# Altium project tinyCore.PrjPcb
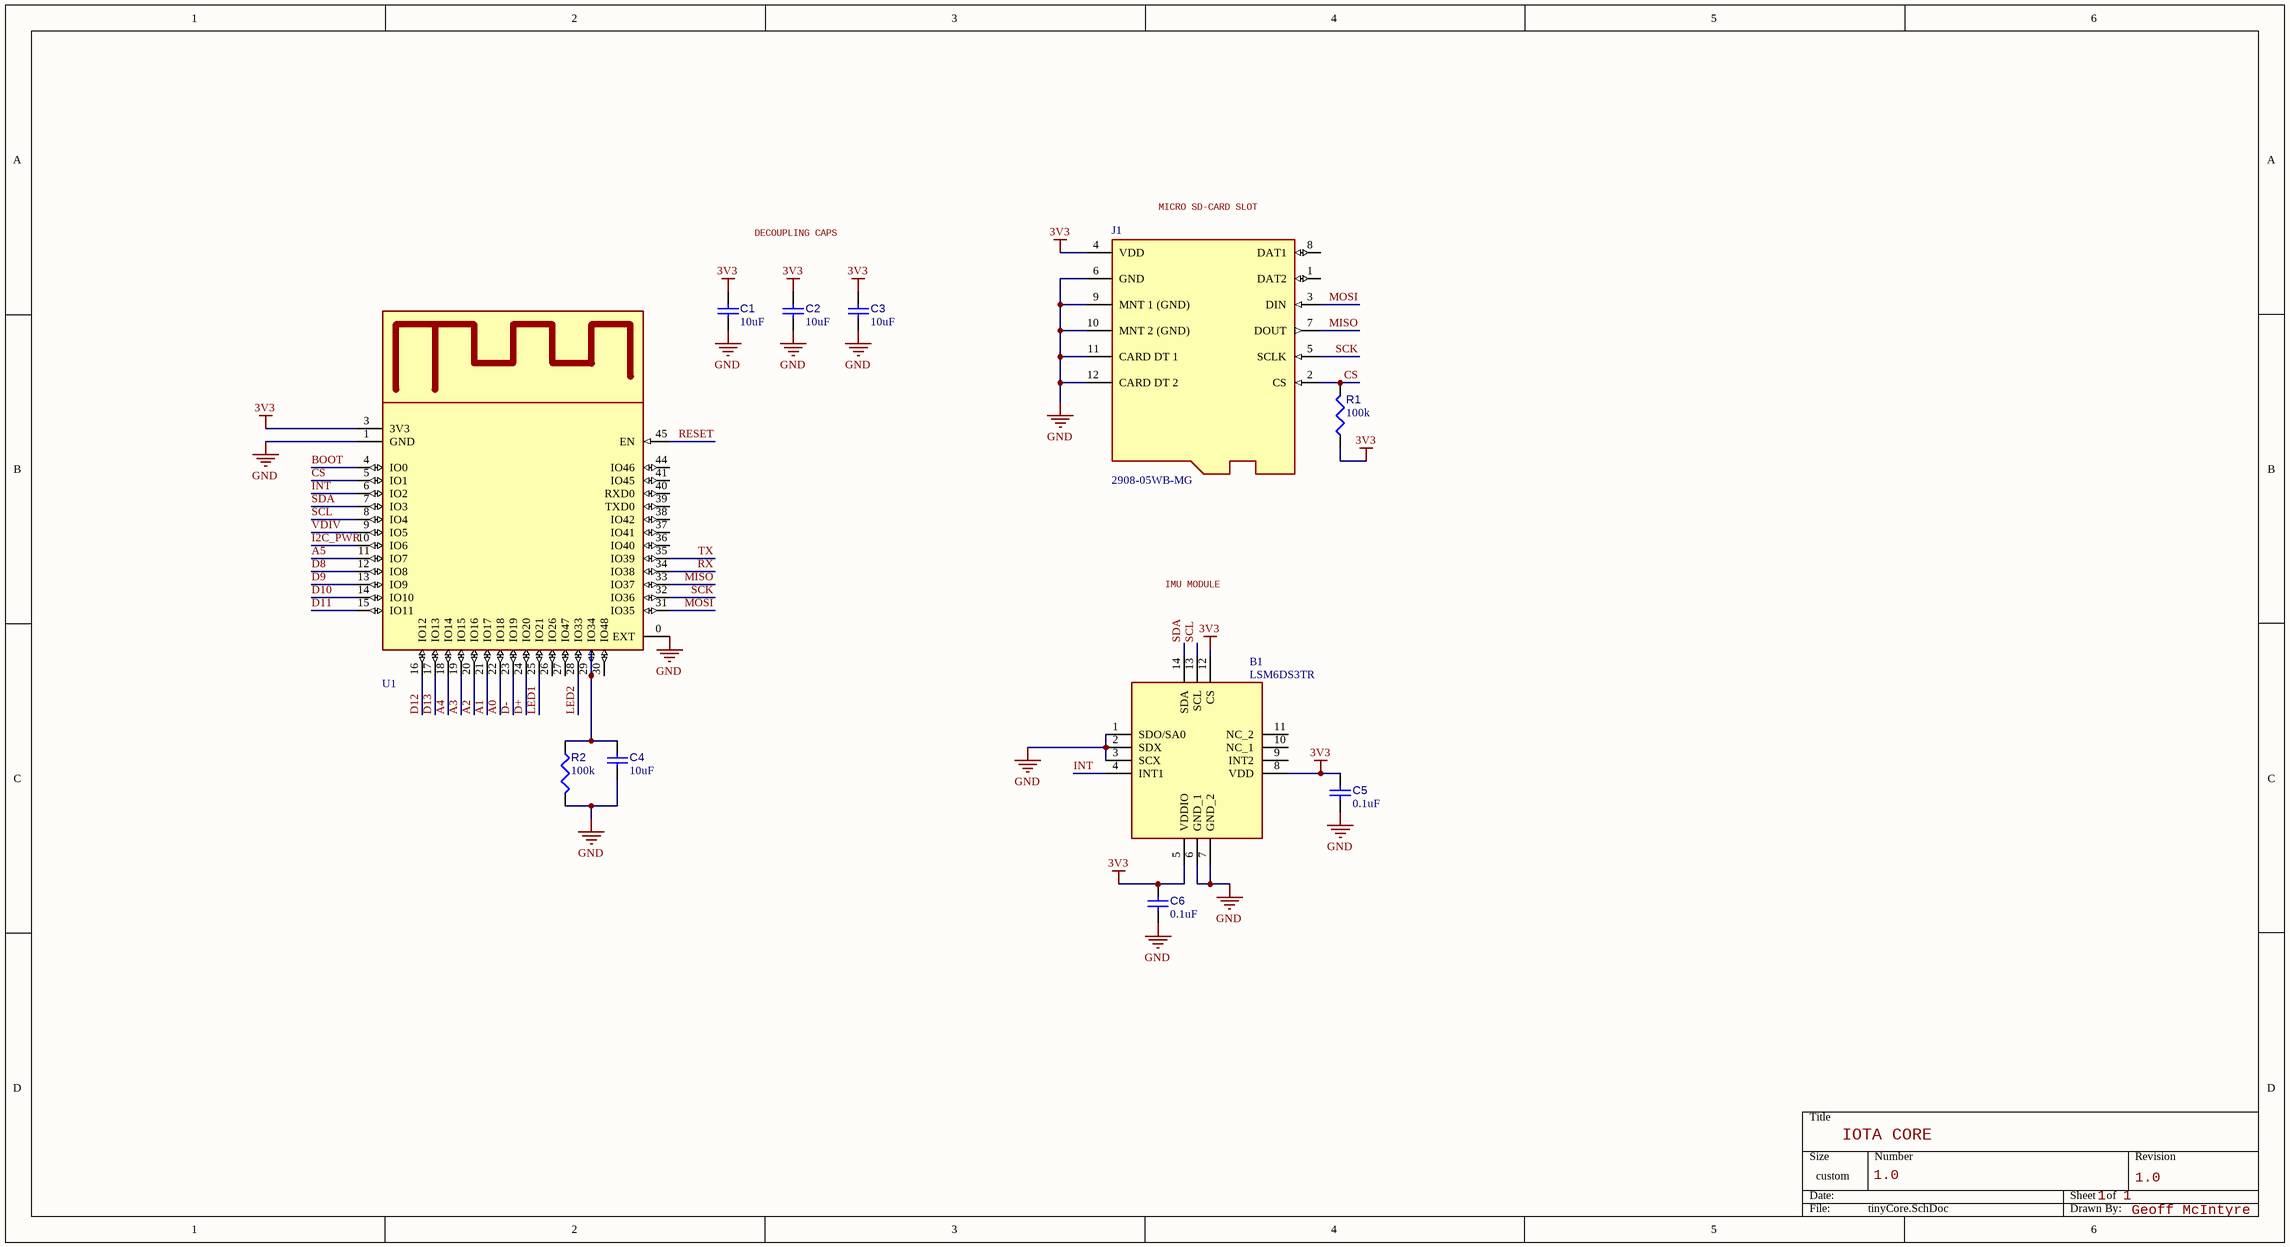
[diagram p0: tinyCore.SchDoc]
4 sheets, 57 parts. Net scope: global (net labels, ports and power ports of the same name join across sheets).
Board file: tinyCore.PcbDoc
Sheets:
  tinyCore.SchDoc
  IO.SchDoc
  Serial.SchDoc
  Power.SchDoc

## Sheet tinyCore.SchDoc
size 444 x 241 mm; SheetNumber: 1; SheetTotal: 4

### Parts
B1  LSM6DS3TR  [LSM6DS3TR]
C1  value 10uF  [CAPC1608X87X35NL15T15]  (hidden comment: Capacitor 10 uF +/- 0.25 uF 50 V 0603)
C2  value 10uF  [CAPC1608X87X35NL15T15]  (hidden comment: Capacitor 10 uF +/- 0.25 uF 50 V 0603)
C3  value 10uF  [CAPC1608X87X35NL15T15]  (hidden comment: Capacitor 10 uF +/- 0.25 uF 50 V 0603)
C4  value 10uF  [CAPC1608X87X35NL15T15]  (hidden comment: Capacitor 10 uF +/- 0.25 uF 50 V 0603)
C5  value 0.1uF  [CAPC1608X87X35NL15T15]  (hidden comment: Capacitor  0.1 uF 50 V 0603)
C6  value 0.1uF  [CAPC1608X87X35NL15T15]  (hidden comment: Capacitor  0.1 uF 50 V 0603)
J1  2908-05WB-MG  [FP-2908-05WB-MG-MFG]
R1  value 100k  [RESC1608X55X25ML10T15]  (hidden comment: Resistor 100k +/-1% 0603 100 mW)
R2  value 100k  [RESC1608X55X25ML10T15]  (hidden comment: Resistor 100k +/-1% 0603 100 mW)
U1  ESP32-S3-MINI-1-N8  [ESP32-S3-MINI-1-N8]  (value not drawn)

### Nets
3V3: B1.5(VDDIO) B1.8(VDD) B1.12(CS) C1.2 C2.2 C3.2 C5.2 C6.2 J1.4(VDD) R1.1 U1.3(3V3)
GND: B1.1(SDO/SA0) B1.2(SDX) B1.3(SCX) B1.6(GND_1) B1.7(GND_2) C1.1 C2.1 C3.1 C4.1 C5.1 C6.1 J1.6(GND) J1.9(MNT_1_(GND)) J1.10(MNT_2_(GND)) J1.11(CARD_DT_1) J1.12(CARD_DT_2) R2.2 U1.0(EXT) U1.1(GND)
LED1: U1.25(IO21)
A0: U1.22(IO18)
A1: U1.21(IO17)
A2: U1.20(IO16)
A3: U1.19(IO15)
A4: U1.18(IO14)
A5: U1.11(IO7)
BOOT: U1.4(IO0)
CS: J1.2(CS) R1.2 U1.5(IO1)
D8: U1.12(IO8)
D9: U1.13(IO9)
D10: U1.14(IO10)
D11: U1.15(IO11)
D12: U1.16(IO12)
D13: U1.17(IO13)
D+: U1.24(IO20)
D-: U1.23(IO19)
I2C_PWR: U1.10(IO6)
INT: B1.4(INT1) U1.6(IO2)
LED2: U1.28(IO33)
MISO: J1.7(DOUT) U1.33(IO37)
MOSI: J1.3(DIN) U1.31(IO35)
RESET: U1.45(EN)
RX: U1.34(IO38)
SCK: J1.5(SCLK) U1.32(IO36)
SCL: B1.13(SCL) U1.8(IO4)
SDA: B1.14(SDA) U1.7(IO3)
TX: U1.35(IO39)
VDIV: U1.9(IO5)
NetC4_2: C4.2 R2.1 U1.29(IO34)

Not connected (* = marked no-connect by the designer): B1 9(INT2) 10(NC_1) 11(NC_2); J1 1(DAT2) 8(DAT1); U1 26(IO26) 27(IO47) 30(IO48) 36(IO40) 37(IO41) 38(IO42) 39(TXD0) 40(RXD0) 41(IO45) 44(IO46)

### Notes on the sheet
- (near J1) MICRO SD-CARD SLOT
- DECOUPLING CAPS
- IMU MODULE
- IOTA CORE
- 1.0
- 1  1
- Geoff McIntyre

### Library data of the parts
B1 = CMP-084-000000-2: DFD PROTECTION & FILTER; Manufacturer_Name: STMicroelectronics; Geometry.Height: 0.86mm; Mouser Part Number: 511-LSM6DS3TR; Design Item ID: LSM6DS3TR; Arrow Part Number: LSM6DS3TR; Manufacturer_Part_Number: LSM6DS3TR; Datasheet Link: https://www.mouser.com/datasheet/2/389/dm00133076-1798402.pdf; Source: LSM6DS3TR.SchLib; Mouser Price/Stock: https://www.mouser.co.uk/ProductDetail/STMicroelectronics/LSM6DS3TR?qs=Ok1pvOkw6%2FrQmhGoCLrQkA%3D%3D; Arrow Price/Stock: https://www.arrow.com/en/products/lsm6ds3tr/stmicroelectronics?region=nac
C1-C4 = CMP-001-00012-6: Chip Capacitor, 10 uF, +/- 0.25 uF, 50 V, 0603 (1608 Metric); Tolerance: 0.25%; Capacitor Type: Ceramic; Voltage Rating: 50V; Max Operating Temperature: 125°C; RoHS Compliant: True; Mounting Technology: SM; Pins: 2; Case/Package: 0603; Min Operating Temperature: -55°C
C5 C6 = CMP-001-00012-6: Chip Capacitor, 0.1 uF, +/- 0.25 pF, 50 V, 0603 (1608 Metric); Tolerance: 0.25%; Capacitor Type: Ceramic; Voltage Rating: 50V; Max Operating Temperature: 125°C; RoHS Compliant: True; Mounting Technology: SM; Pins: 2; Case/Package: 0603; Min Operating Temperature: -55°C
J1 = CMP-019-00049-1: CONN MICRO SD CARD PUSH-PUSH R/A
R1 R2 = CMP-009-00023-5: Chip Resistor, 100 KOhm, +/- 1%, 0.1 W, -55 to 155 degC, 0603 (1608 Metric); Voltage Rating: 50V; Power: 100mW; Max Operating Temperature: 155°C; RoHS Compliant: True; Tolerance: 1%; Pins: 2; Case/Package: 0603; Mounting Technology: SM; Min Operating Temperature: -55°C
U1 = CMP-010-000006-5: SMD module, ESP32-S3FN8, 8 MB SPI flash, PCB antenna; Manufacturer: Espressif Systems; Nominal Vf: 3V ~ 3.6V; Min Operating Temperature: -40°C; Source: ESP32-S3-MINI-1-N8.SchLib; DigiKey Part Number: 1965-ESP32-S3-MINI-1-N8CT-ND; Mounting Technology: Surface Mount; Manufacturer Part Number: ESP32-S3-MINI-1-N8; Component Type: Microcontroller; RoHS Compliant: Yes; Max Operating Temperature: 85°C; Pins: 73; Case/Package: 41-SMD Module; Availability: In Stock

## Sheet IO.SchDoc
size A; SheetNumber: 2; SheetTotal: 4
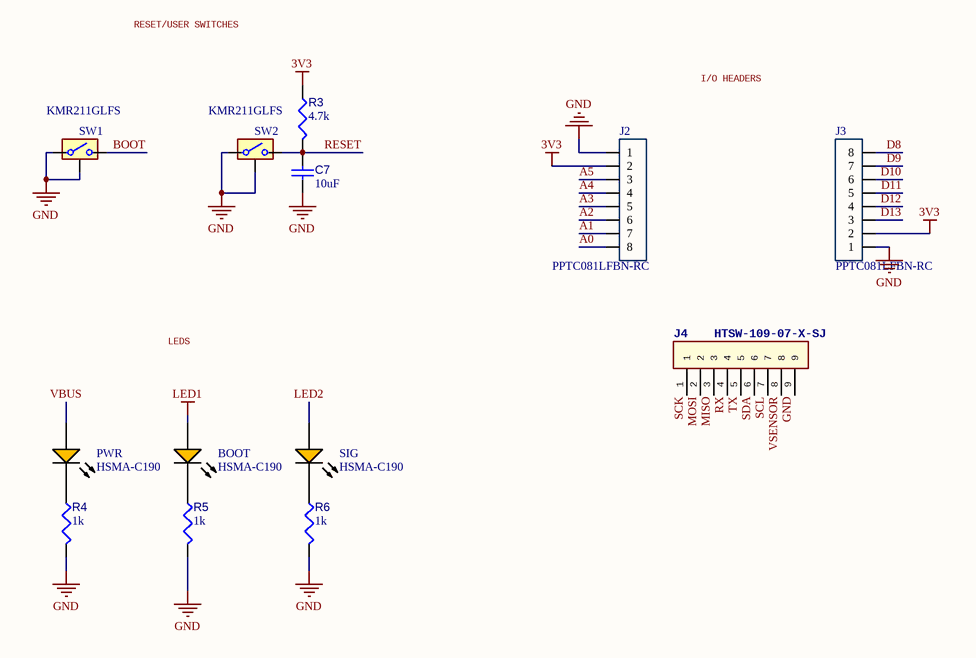
[diagram p1: IO.SchDoc]

### Parts
BOOT  HSMA-C190  [AVAG-HSMX-C190_V]
C7  value 10uF  [CAPC1608X87X35NL15T15]  (hidden comment: Capacitor 10 uF +/- 0.25 uF 50 V 0603)
J2  PPTC081LFBN-RC  [8_PIN_100MIL - Female]
J3  PPTC081LFBN-RC  [8_PIN_100MIL - Female]
J4  HTSW-109-07-X-SJ  [JM-9_HTSW-109-07-X-S]
PWR  HSMA-C190  [AVAG-HSMX-C190_V]
R3  value 4.7k  [RESC1608X55X25ML10T15]  (hidden comment: Resistor 4.7k +/-1% 0603 100 mW)
R4  value 1k  [RESC1608X55X25ML10T15]  (hidden comment: Resistor 1k +/-1% 0603 100 mW)
R5  value 1k  [RESC1608X55X25ML10T15]  (hidden comment: Resistor 1k +/-1% 0603 100 mW)
R6  value 1k  [RESC1608X55X25ML10T15]  (hidden comment: Resistor 1k +/-1% 0603 100 mW)
SIG  HSMA-C190  [AVAG-HSMX-C190_V]
SW1  KMR211GLFS  [FP-KMR211GLFS-MFG]
SW2  KMR211GLFS  [FP-KMR211GLFS-MFG]

### Nets
3V3: J2.2 J3.2 R3.1
GND: C7.1 J2.1 J3.1 J4.9 R4.2 R5.2 R6.2 SW1.1,2 SW1.5 SW2.1,2 SW2.5
LED1: BOOT.1(A)
VBUS: PWR.1(A)
A0: J2.8
A1: J2.7
A2: J2.6
A3: J2.5
A4: J2.4
A5: J2.3
BOOT: SW1.3,4
D8: J3.8
D9: J3.7
D10: J3.6
D11: J3.5
D12: J3.4
D13: J3.3
LED2: SIG.1(A)
MISO: J4.3
MOSI: J4.2
RESET: C7.2 R3.2 SW2.3,4
RX: J4.4
SCK: J4.1
SCL: J4.7
SDA: J4.6
TX: J4.5
VSENSOR: J4.8
NetBOOT_2: BOOT.2(K) R5.1
NetPWR_2: PWR.2(K) R4.1
NetR6_1: R6.1 SIG.2(K)

### Notes on the sheet
- RESET/USER SWITCHES
- I/O HEADERS
- LEDS

### Library data of the parts
BOOT PWR SIG = CMP-007-00011-2: LED Uni-Color Amber, 60 mW, 20 mA, -40 to 85 degC, 2-Pin SMD, RoHS, Tape and Reel; Manufacturer: Avago; Forward Current: 20mA; Luminous Intensity: 90mcd; Lens Style: Diffused; Power: 60mW; Nominal Vf: 1.9V; Viewing Angle: 170degrees; Illumination Colour: Orange; Datasheet Version: Sep-10; Mounting Technology: SM; Case/Package: 0603; RoHS Compliant: True; Pins: 2; Packaging: TapeandReel; Colour: Orange; Package Reference: HSMX-C190; Manufacturer URL: http://www.avagotech.com/; Package Quantity: 4000; Min Operating Temperature: -40°C; Datasheet URL: http://docs.avagotech.com/docs/AV02-0112EN; Max Operating Temperature: 85°C; Forward Voltage: 1.9V; Package Description: 2-Pin Surface Mount Device, Body 1.6 x 0.8 mm, Height 0.9 mm
C7 = CMP-001-00012-6: as C1 on sheet tinyCore; Max Operating Temperature: 125°C; RoHS Compliant: True; Mounting Technology: SM; Pins: 2; Case/Package: 0603; Min Operating Temperature: -55°C
J2 J3 = JF_8_PIN_FEMALE: 8 Position Header Connector 0.100" (2.54mm) Through Hole Tin; Digikey Link: https://www.digikey.com/product-detail/en/PPTC081LFBN-RC/S7006-ND/810147/?itemSeq=304982354; MFR Part #: PPTC081LFBN-RC; Type: Extended; LCSC Part#: C27438
J4 = JM_9_PIN_MALE: 2.54mm Black 1x9P Straight,P=2.54mm Pin Headers; MFR PART #: PZ254-1-09-Z-8.5; MFR PN: HTSW-109-07-X-SJ; LCSC PART#: C2894932
R3 = CMP-009-00023-5: Chip Resistor, 4.7 KOhm, +/- 1%, 0.1 W, -55 to 155 degC, 0603 (1608 Metric); Voltage Rating: 50V; Power: 100mW; Max Operating Temperature: 155°C; RoHS Compliant: True; Tolerance: 1%; Pins: 2; Case/Package: 0603; Mounting Technology: SM; Min Operating Temperature: -55°C
R4-R6 = CMP-009-00023-5: Chip Resistor, 1 KOhm, +/- 1%, 0.1 W, -55 to 155 degC, 0603 (1608 Metric); Voltage Rating: 50V; Power: 100mW; Max Operating Temperature: 155°C; RoHS Compliant: True; Tolerance: 1%; Pins: 2; Case/Package: 0603; Mounting Technology: SM; Min Operating Temperature: -55°C
SW1 SW2 = CMP-011-00013-6: Design Item ID: KMR211GLFS; Source: KMR211GLFS.SchLib

## Sheet Serial.SchDoc
size A; SheetNumber: 3; SheetTotal: 4
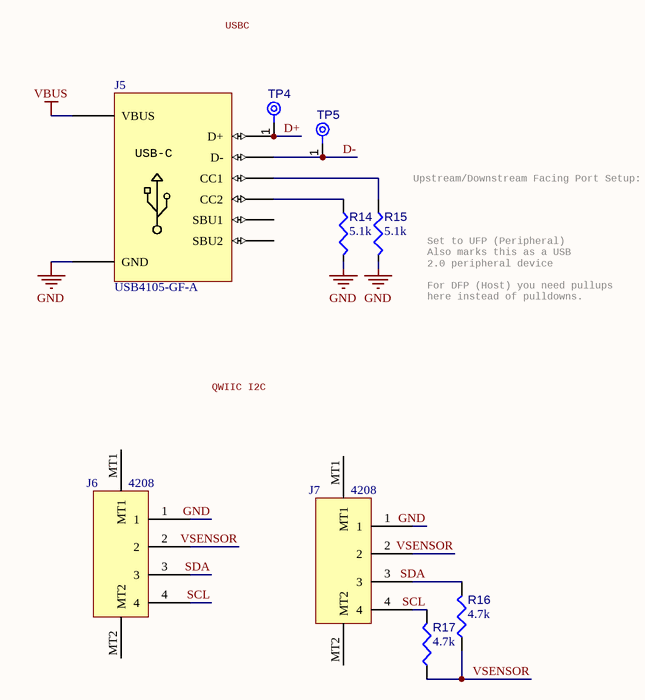
[diagram p2: Serial.SchDoc]

### Parts
J5  USB4105-GF-A  [USB4105-GF-A]
J6  4208  [4390]
J7  4208  [4390]
R14  value 5.1k  [RESC1608X55X25ML10T15]  (hidden comment: Resistor 5.1k +/-1% 0603 100 mW)
R15  value 5.1k  [RESC1608X55X25ML10T15]  (hidden comment: Resistor 5.1k +/-1% 0603 100 mW)
R16  value 4.7k  [RESC1608X55X25ML10T15]  (hidden comment: Resistor 4.7k +/-1% 0603 100 mW)
R17  value 4.7k  [RESC1608X55X25ML10T15]  (hidden comment: Resistor 4.7k +/-1% 0603 100 mW)
TP4  TPAD6R  [TP06R]  (value not drawn)  (no BOM)
TP5  TPAD6R  [TP06R]  (value not drawn)  (no BOM)

### Nets
GND: J5.A1B12,B1A12,M1,M2,M3,M4(GND) J6.1 J7.1 R14.2 R15.2
VBUS: J5.A4B9,B4A9(VBUS)
D+: J5.A6,B6(D+) TP4.1(TP)
D-: J5.A7,B7(D-) TP5.1(TP)
SCL: J6.4 J7.4 R17.2
SDA: J6.3 J7.3 R16.2
VSENSOR: J6.2 J7.2 R16.1 R17.1
NetJ5_A5: J5.A5(CC1) R15.1
NetJ5_B5: J5.B5(CC2) R14.1

Not connected (* = marked no-connect by the designer): J5 A8(SBU1) B8(SBU2); J6 MT1 MT2; J7 MT1 MT2

### Notes on the sheet
- USBC
- (near R15) Upstream/Downstream Facing Port Setup:
- (near R15) Set to UFP (Peripheral)
  Also marks this as a USB
  2.0 peripheral device
  For DFP (Host) you need pullups
  here instead of pulldowns.
- QWIIC I2C
- (in symbol CMP-013-000000-1) USB-C

### Library data of the parts
J5 = CMP-013-000000-1: USB-C 16-Pin Component; Source: USB4105-GF-A.SchLib; Design Item ID: USB4105-GF-A
J6 J7 = CMP-002-00080-4: Adafruit Accessories JST SH 4-pin Right Angle Connector (10-pack) - Qwiic Compatible; Manufacturer_Part_Number: 4208; Source: SamacSys.SchLib; Height: 7.05mm; Design Item ID: 4208; Manufacturer_Name: Adafruit; Datasheet Link: https://cdn-shop.adafruit.com/product-files/4390/4390_C13925-001_CCP-W20-04-BK-SMT-R-A.PDF
R14 R15 = CMP-009-00023-5: Chip Resistor, 5.1 KOhm, +/- 1%, 0.1 W, -55 to 155 degC, 0603 (1608 Metric); Voltage Rating: 50V; Power: 100mW; Max Operating Temperature: 155°C; RoHS Compliant: True; Tolerance: 1%; Pins: 2; Case/Package: 0603; Mounting Technology: SM; Min Operating Temperature: -55°C
R16 R17 = CMP-009-00023-5: as R3 on sheet IO; Max Operating Temperature: 155°C; RoHS Compliant: True; Tolerance: 1%; Pins: 2; Case/Package: 0603; Mounting Technology: SM; Min Operating Temperature: -55°C
TP4 TP5 = CMP-00028-00002-2: 0.6mm round; Pins: 1

## Sheet Power.SchDoc
size A; SheetNumber: 4; SheetTotal: 4
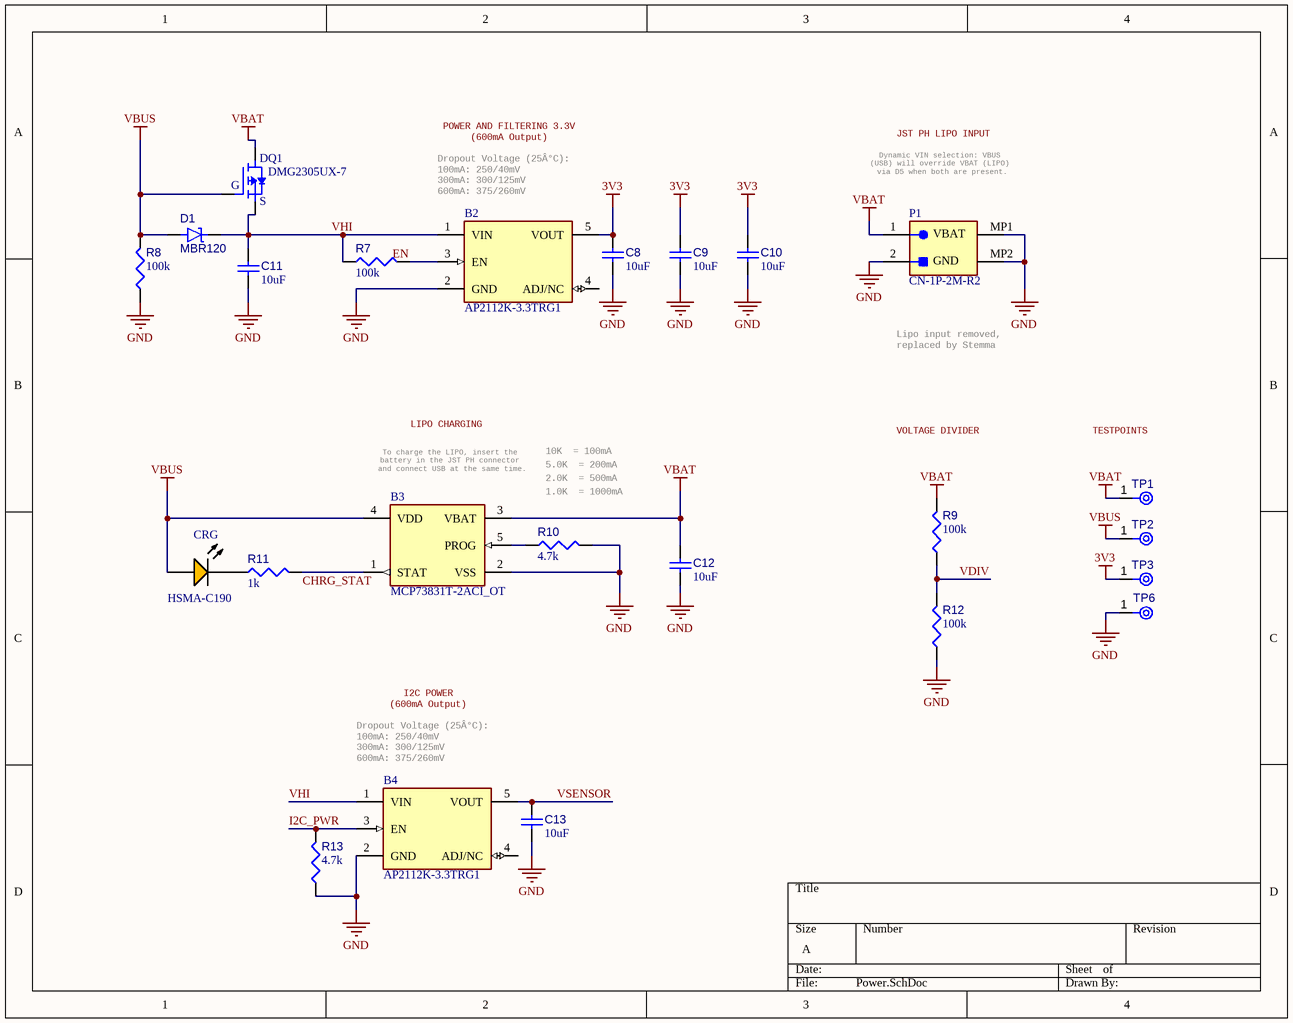
[diagram p3: Power.SchDoc]

### Parts
B2  AP2112K-3.3TRG1  [SOT95P270X145-5N]
B3  MCP73831T-2ACI_OT  [SOT95P270X145-5N]
B4  AP2112K-3.3TRG1  [SOT95P270X145-5N]
C8  value 10uF  [CAPC1608X87X35NL15T15]  (hidden comment: Capacitor 10 uF +/- 0.25 uF 50 V 0603)
C9  value 10uF  [CAPC1608X87X35NL15T15]  (hidden comment: Capacitor 10 uF +/- 0.25 uF 50 V 0603)
C10  value 10uF  [CAPC1608X87X35NL15T15]  (hidden comment: Capacitor 10 uF +/- 0.25 uF 50 V 0603)
C11  value 10uF  [CAPC1608X87X35NL15T15]  (hidden comment: Capacitor 10 uF +/- 0.25 uF 50 V 0603)
C12  value 10uF  [CAPC1608X87X35NL15T15]  (hidden comment: Capacitor 10 uF +/- 0.25 uF 50 V 0603)
C13  value 10uF  [CAPC1608X87X35NL15T15]  (hidden comment: Capacitor 10 uF +/- 0.25 uF 50 V 0603)
CRG  HSMA-C190  [AVAG-HSMX-C190_V]
D1  MBR120  [ONSC-SOD-123FL-2-498-01_V]
P1  CN-1P-2M-R2  [JST- S2B-PH-SM4-TB(LF)(SN)-2_V]
Q1  DMG2305UX-7  [FP-SOT23-MFG]
R7  value 100k  [RESC1608X55X25ML10T15]  (hidden comment: Resistor 100k +/-1% 0603 100 mW)
R8  value 100k  [RESC1608X55X25ML10T15]  (hidden comment: Resistor 100k +/-1% 0603 100 mW)
R9  value 100k  [RESC1608X55X25ML10T15]  (hidden comment: Resistor 100k +/-1% 0603 100 mW)
R10  value 4.7k  [RESC1608X55X25ML10T15]  (hidden comment: Resistor 4.7k +/-1% 0603 100 mW)
R11  value 1k  [RESC1608X55X25ML10T15]  (hidden comment: Resistor 1k +/-1% 0603 100 mW)
R12  value 100k  [RESC1608X55X25ML10T15]  (hidden comment: Resistor 100k +/-1% 0603 100 mW)
R13  value 4.7k  [RESC1608X55X25ML10T15]  (hidden comment: Resistor 4.7k +/-1% 0603 100 mW)
TP1  TPAD6R  [TP06R]  (value not drawn)  (no BOM)
TP2  TPAD6R  [TP06R]  (value not drawn)  (no BOM)
TP3  TPAD6R  [TP06R]  (value not drawn)  (no BOM)
TP6  TPAD6R  [TP06R]  (value not drawn)  (no BOM)

### Nets
3V3: B2.5(VOUT) C8.2 C9.2 C10.2 TP3.1(TP)
GND: B2.2(GND) B3.2(VSS) B4.2(GND) C8.1 C9.1 C10.1 C11.1 C12.1 C13.1 P1.2 P1.MP1 P1.MP2 R8.1 R10.2 R12.1 R13.1 TP6.1(TP)
VBAT: B3.3(VBAT) C12.2 P1.1 Q1.3(D) R9.2 TP1.1(TP)
VBUS: B3.4(VDD) CRG.1(A) D1.2(A) Q1.1(G) R8.2 TP2.1(TP)
CHRG_STAT: B3.1(STAT) R11.2
EN: B2.3(EN) R7.2
I2C_PWR: B4.3(EN) R13.2
VDIV: R9.1 R12.2
VHI: B2.1(VIN) B4.1(VIN) C11.2 D1.1(K) Q1.2(S) R7.1
VSENSOR: B4.5(VOUT) C13.2
NetB3_5: B3.5(PROG) R10.1
NetCRG_2: CRG.2(K) R11.1

Not connected (* = marked no-connect by the designer): B2 4(ADJ/NC); B4 4(ADJ/NC)

### Notes on the sheet
- POWER AND FILTERING 3.3V
  (600mA Output)
- JST PH LIPO INPUT
- Dropout Voltage (25Â°C):
  100mA: 250/40mV
  300mA: 300/125mV
  600mA: 375/260mV
- Dynamic VIN selection: VBUS
  (USB) will override VBAT (LIPO)
  via D5 when both are present.
- Lipo input removed, replaced by Stemma
- LIPO CHARGING
- VOLTAGE DIVIDER
- TESTPOINTS
- To charge the LIPO, insert the
  battery in the JST PH connector
  and connect USB at the same time.
- 10K  = 100mA
- 5.0K  = 200mA
- 2.0K  = 500mA
- 1.0K  = 1000mA
- I2C POWER
  (600mA Output)
- (in symbol CMP-005-000001-1) VBAT; GND

### Library data of the parts
B2 B4 = CMP-007-000001-1: 600mA 3.3V LDO Regulator Enable SOT23-5 DiodesZetex AP2112K-3.3TRG1, LDO Voltage Regulator, 3.3 V +/-1.5%, 2.5  6 Vin, 5-Pin SOT-23; Manufacturer_Name: Diodes Inc.; Geometry.Height: 1.3mm; Mouser Part Number: 621-AP2112K-3.3TRG1; Source: AP2112K-3.3TRG1.SchLib; Datasheet Link: *; Manufacturer_Part_Number: AP2112K-3.3TRG1; Mouser Price/Stock: https://www.mouser.co.uk/ProductDetail/Diodes-Incorporated/AP2112K-3.3TRG1?qs=x6A8l6qLYDDPYHosCdzh%2FA%3D%3D; Design Item ID: AP2112K-3.3TRG1
B3 = CMP-009-000000-1: Li-Ion Charge Controller 4.2V SOT23-5; Manufacturer_Name: Microchip; Manufacturer_Part_Number: MCP73831T-2ACI/OT; Geometry.Height: 1.45mm; Design Item ID: MCP73831T-2ACI_OT; Mouser Part Number: 579-MCP73831T-2ACIOT; Datasheet Link: http://ww1.microchip.com/downloads/en/DeviceDoc/20001984g.pdf; Source: MCP73831T-2ACI_OT.SchLib; Mouser Price/Stock: https://www.mouser.co.uk/ProductDetail/Microchip-Technology-Atmel/MCP73831T-2ACI-OT?qs=yUQqVecv4qvbBQBGbHx0Mw%3D%3D
C8-C13 = CMP-001-00012-6: as C1 on sheet tinyCore; Max Operating Temperature: 125°C; RoHS Compliant: True; Mounting Technology: SM; Pins: 2; Case/Package: 0603; Min Operating Temperature: -55°C
CRG = CMP-007-00011-2: as BOOT on sheet IO; Datasheet Version: Sep-10; Mounting Technology: SM; Case/Package: 0603; RoHS Compliant: True; Pins: 2; Packaging: TapeandReel; Colour: Orange; Package Reference: HSMX-C190; Manufacturer URL: http://www.avagotech.com/; Package Quantity: 4000; Min Operating Temperature: -40°C; Datasheet URL: http://docs.avagotech.com/docs/AV02-0112EN; Max Operating Temperature: 85°C; Forward Voltage: 1.9V; Package Description: 2-Pin Surface Mount Device, Body 1.6 x 0.8 mm, Height 0.9 mm
D1 = CMP-004-00031-1: Diode; Source: MBR120.SchLib; Design Item ID: MBR120
P1 = CMP-005-000001-1: Design Item ID: CN-1P-2M-R2; Source: CN-1P-2M-R2.SchLib
Q1 = CMP001-1: Power Field-Effect Transistor, 4.2A I(D), 20V, 0.052ohm, 1-Element, P-Channel, Silicon, Metal-oxide Semiconductor FET; Max Operating Temperature: 150°C; RoHS Compliant: Yes; Pins: 3
R7-R9 R12 = CMP-009-00023-5: as R1 on sheet tinyCore; Max Operating Temperature: 155°C; RoHS Compliant: True; Tolerance: 1%; Pins: 2; Case/Package: 0603; Mounting Technology: SM; Min Operating Temperature: -55°C
R10 R13 = CMP-009-00023-5: as R3 on sheet IO; Max Operating Temperature: 155°C; RoHS Compliant: True; Tolerance: 1%; Pins: 2; Case/Package: 0603; Mounting Technology: SM; Min Operating Temperature: -55°C
R11 = CMP-009-00023-5: as R4 on sheet IO; Max Operating Temperature: 155°C; RoHS Compliant: True; Tolerance: 1%; Pins: 2; Case/Package: 0603; Mounting Technology: SM; Min Operating Temperature: -55°C
TP1-TP3 TP6 = CMP-00028-00002-2: 0.6mm round; Pins: 1

## Nets that join several sheets
3V3: tinyCore (11 pins), IO (J2.2 J3.2 R3.1), Power (5 pins)
GND: tinyCore (19 pins), IO (11 pins), Serial (5 pins), Power (17 pins)
LED1: tinyCore (U1.25), IO (BOOT.1)
VBUS: IO (PWR.1), Serial (J5.A4B9,B4A9), Power (6 pins)
A0: tinyCore (U1.22), IO (J2.8)
A1: tinyCore (U1.21), IO (J2.7)
A2: tinyCore (U1.20), IO (J2.6)
A3: tinyCore (U1.19), IO (J2.5)
A4: tinyCore (U1.18), IO (J2.4)
A5: tinyCore (U1.11), IO (J2.3)
BOOT: tinyCore (U1.4), IO (SW1.3,4)
D8: tinyCore (U1.12), IO (J3.8)
D9: tinyCore (U1.13), IO (J3.7)
D10: tinyCore (U1.14), IO (J3.6)
D11: tinyCore (U1.15), IO (J3.5)
D12: tinyCore (U1.16), IO (J3.4)
D13: tinyCore (U1.17), IO (J3.3)
D+: tinyCore (U1.24), Serial (J5.A6,B6 TP4.1)
D-: tinyCore (U1.23), Serial (J5.A7,B7 TP5.1)
I2C_PWR: tinyCore (U1.10), Power (B4.3 R13.2)
LED2: tinyCore (U1.28), IO (SIG.1)
MISO: tinyCore (J1.7 U1.33), IO (J4.3)
MOSI: tinyCore (J1.3 U1.31), IO (J4.2)
RESET: tinyCore (U1.45), IO (C7.2 R3.2 SW2.3,4)
RX: tinyCore (U1.34), IO (J4.4)
SCK: tinyCore (J1.5 U1.32), IO (J4.1)
SCL: tinyCore (B1.13 U1.8), IO (J4.7), Serial (J6.4 J7.4 R17.2)
SDA: tinyCore (B1.14 U1.7), IO (J4.6), Serial (J6.3 J7.3 R16.2)
TX: tinyCore (U1.35), IO (J4.5)
VDIV: tinyCore (U1.9), Power (R9.1 R12.2)
VSENSOR: IO (J4.8), Serial (J6.2 J7.2 R16.1 R17.1), Power (B4.5 C13.2)